# EAGLE design doch (EAGLE 9.6.2)
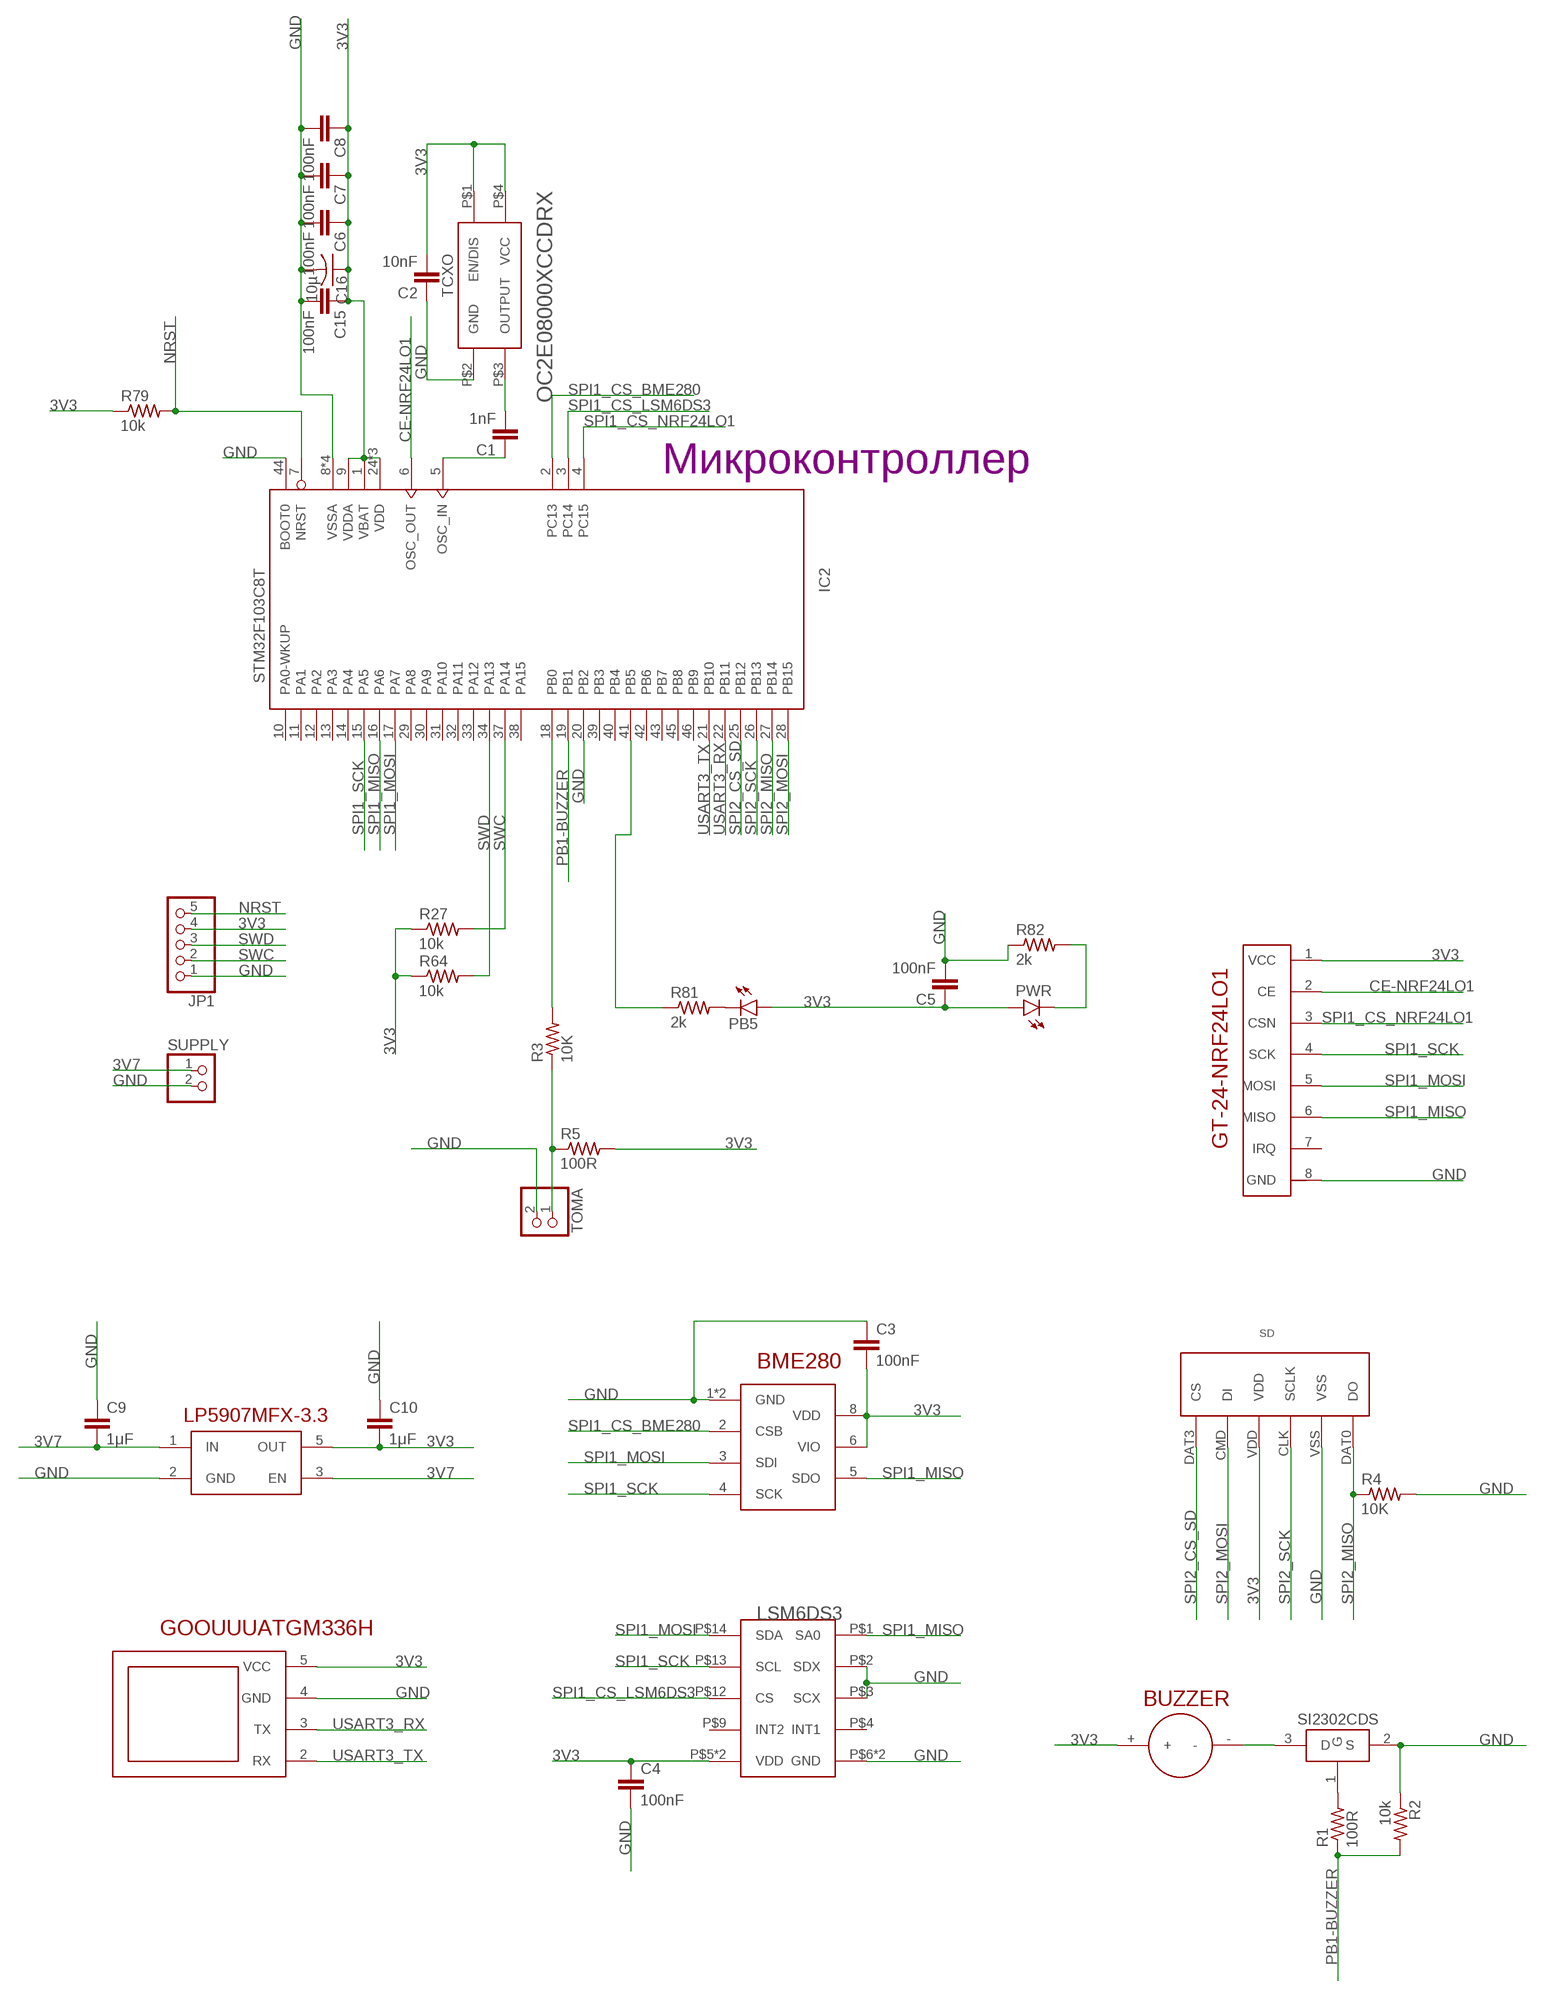
[diagram p0: schematic, sheet 1]

## Parts
BME280  BME280CHIP  [BME280CHIP]
BUZZER  BUZZER  [BUZZER]
C1  1nF  C-EUC0603  [C0603]
C2  10nF  C-EUC0603  [C0603]
C3  100nF  C-EUC0603  [C0603]
C4  100nF  C-EUC0603  [C0603]
C5  100nF  C-EUC0603  [C0603]
C6  100nF  C-EUC0603  [C0603]
C7  100nF  C-EUC0603  [C0603]
C8  100nF  C-EUC0603  [C0603]
C9  1μF  C-EUC0603  [C0603]
C10  1μF  C-EUC0603  [C0603]
C15  100nF  C-EUC0603  [C0603]
C16  10µ  C-USC1206  [C1206]
GOOUUUATGM336H  GOOUUUATGM336H  [GOOUUUATGM336H]
GT-24-NRF24LO1  GT-24-NRF24LO1  [GT-24-NRF24LO1]
IC2  STM32F103C8T  [LQFP48]
JP1  PINHD-1X5  [1X05]
LP5907MFX-3.3  LP5907MFX-3.3  [5PINSOT23]
LSM6DS3  LSM6DS3  [LGA-14]
PB5  LEDCHIPLED_0603  [CHIPLED_0603]
PWR  LEDCHIPLED_0603  [CHIPLED_0603]
R1  100R  R-US_R0603  [R0603]
R2  10k  R-US_R0603  [R0603]
R3  10K  R-US_R0603  [R0603]
R4  10K  R-US_R0603  [R0603]
R5  100R  R-US_R0603  [R0603]
R27  10k  R-US_R0603  [R0603]
R64  10k  R-US_R0603  [R0603]
R79  10k  R-US_R0603  [R0603]
R81  2k  R-US_R0603  [R0603]
R82  2k  R-US_R0603  [R0603]
SD  SD-SPI  [SD]
SUPPLY  PINHD-1X2  [1X02]
TCXO  OC2E08000XCCDRX  [OC2E08000XCCDRX]
TOMA  PINHD-1X2/90  [1X02/90]
U$1  SI2302CDS  [SOT23-3]

## Nets
3V3: BME280.6(VIO) BME280.8(VDD) BUZZER.+ C2.2 C3.2 C4.1 C5.1 C6.1 C7.1 C8.1 C10.2 C15.1 C16.1 GOOUUUATGM336H.5(VCC) GT-24-NRF24LO1.1(VCC) IC2.1(VBAT) IC2.9(VDDA) IC2.24(VDD) IC2.36(VDD) IC2.48(VDD) JP1.4 LP5907MFX-3.3.5(OUT) LSM6DS3.P$5(VDD) LSM6DS3.P$8(VDD) PB5.A PWR.A R5.2 R27.1 R64.1 R79.1 SD.VDD TCXO.P$1(EN/DIS) TCXO.P$4(VCC)
3V7: C9.2 LP5907MFX-3.3.1(IN) LP5907MFX-3.3.3(EN) SUPPLY.1
CE-NRF24LO1: GT-24-NRF24LO1.2(CE) IC2.6(OSC_OUT)
GND: BME280.1(GND) BME280.7(GND) C2.1 C3.1 C4.2 C5.2 C6.2 C7.2 C8.2 C9.1 C10.1 C15.2 C16.2 GOOUUUATGM336H.4(GND) GT-24-NRF24LO1.8(GND) IC2.8(VSSA) IC2.20(PB2) IC2.23(VSSA) IC2.35(VSSA) IC2.44(BOOT0) IC2.47(VSSA) JP1.1 LP5907MFX-3.3.2(GND) LSM6DS3.P$2(SDX) LSM6DS3.P$3(SCX) LSM6DS3.P$6(GND) LSM6DS3.P$7(GND) R2.1 R4.2 R82.1 SD.VSS SUPPLY.2 TCXO.P$2(GND) TOMA.2 U$1.2(S)
N$1: BUZZER.- U$1.3(D)
N$2: R1.2 U$1.1(G)
N$4: C1.2 TCXO.P$3(OUTPUT)
N$5: C1.1 IC2.5(OSC_IN)
N$8: R3.1 R5.1 TOMA.1
N$9: IC2.18(PB0) R3.2
N$17: PB5.C R81.2
N$159: PWR.C R82.2
N$161: IC2.41(PB5) R81.1
NRST: IC2.7(NRST) JP1.5 R79.2
PB1-BUZZER: IC2.19(PB1) R1.1 R2.2
SPI1_CS_BME280: BME280.2(CSB) IC2.2(PC13)
SPI1_CS_LSM6DS3: IC2.3(PC14) LSM6DS3.P$12(CS)
SPI1_CS_NRF24LO1: GT-24-NRF24LO1.3(CSN) IC2.4(PC15)
SPI1_MISO: BME280.5(SDO) GT-24-NRF24LO1.6(MISO) IC2.16(PA6) LSM6DS3.P$1(SA0)
SPI1_MOSI: BME280.3(SDI) GT-24-NRF24LO1.5(MOSI) IC2.17(PA7) LSM6DS3.P$14(SDA)
SPI1_SCK: BME280.4(SCK) GT-24-NRF24LO1.4(SCK) IC2.15(PA5) LSM6DS3.P$13(SCL)
SPI2_CS_SD: IC2.25(PB12) SD.DAT3(CS)
SPI2_MISO: IC2.27(PB14) R4.1 SD.DAT0(DO)
SPI2_MOSI: IC2.28(PB15) SD.CMD(DI)
SPI2_SCK: IC2.26(PB13) SD.CLK(SCLK)
SWC: IC2.37(PA14) JP1.2 R27.2
SWD: IC2.34(PA13) JP1.3 R64.2
USART3_RX: GOOUUUATGM336H.3(TX) IC2.22(PB11)
USART3_TX: GOOUUUATGM336H.2(RX) IC2.21(PB10)
Unconnected: GT-24-NRF24LO1.7(IRQ) IC2.10(PA0-WKUP) IC2.11(PA1) IC2.12(PA2) IC2.13(PA3) IC2.14(PA4) IC2.29(PA8) IC2.30(PA9) IC2.31(PA10) IC2.32(PA11) IC2.33(PA12) IC2.38(PA15) IC2.39(PB3) IC2.40(PB4) IC2.42(PB6) IC2.43(PB7) IC2.45(PB8) IC2.46(PB9) LSM6DS3.P$4(INT1) LSM6DS3.P$9(INT2)

## Notes on the sheet
- Микроконтроллер

## Library data of the parts
BME280 = CanCubeSat:BME280CHIP
BUZZER = CanCubeSat:BUZZER
C1-C10 C15 = rcl:C-EU: CAPACITOR, European symbol; SPICEPREFIX: C
C16 = rcl:C-US: CAPACITOR, American symbol; SPICEPREFIX: C
GOOUUUATGM336H = CanCubeSat:GOOUUUATGM336H
GT-24-NRF24LO1 = CanCubeSat:GT-24-NRF24LO1
IC2 = CanCubeSat:STM32F103C*T: ARM 32-bit Cortex™-M3 CPU 72 MHz maximum frequency 16 to 128 Kbytes of Flash memory 6 to 20 kbytes of SRAM 37 GPIOs 2.0 to 3.6 V application supply
JP1 = pinhead:PINHD-1X5: PIN HEADER
LP5907MFX-3.3 = CanCubeSat:LP5907MFX-3.3
LSM6DS3 = CanCubeSat:LSM6DS3
PB5 PWR = led:LED: LED OSRAM: - CHIPLED LG R971, LG N971, LY N971, LG Q971, LY Q971, LO R971, LY R971 LH N974, LH R974 LS Q976, LO Q976, LY Q976 LO Q996 - Hyper CHIPLED LW Q18S LB Q993, LB Q99A, LB R99A - SideLED LS A670, LO A670, LY A670, LG A670, LP A670 LB A673, LV A673, LT A673, LW A673 LH A674 LY A675 LS A676, LA A676, LO A676, LY A676, LW A676 LS A679, LY A679, LG A679 - Hyper Micro SIDELED® LS Y876, LA Y876, LO Y876, LY Y876 LT Y87S - SmartLED LW L88C, LW L88S LB L89C, LB L89S, LG L890 LS L89K, LO L89K, LY L89K LS L896, LA L896, LO L896, LY L896 - TOPLED LS T670, LO T670, LY T670, LG T670, LP T670 LSG T670, LSP T670, LSY T670, LOP T670, LYG T670 LG T671, LOG T671, LSG T671 LB T673, LV T673, LT T673, LW T673 LH T674 LS T676, LA T676, LO T676, LY T676, LB T676, LH T676, LSB T676, LW T676 LB T67C, LV T67C, LT T67C, LS T67K, LO T67K, LY T67K, LW E67C LS E67B, LA E67B, LO E67B, LY E67B, LB E67C, LV E67C, LT E67C LW T67C LS T679, LY T679, LG T679 LS T770, LO T770, LY T770, LG T770, LP T770 LB T773, LV T773, LT T773, LW T773 LH T774 LS E675, LA E675, LY E675, LS T675 LS T776, LA T776, LO T776, LY T776, LB T776 LHGB T686 LT T68C, LB T68C - Hyper Mini TOPLED® LB M676 - Mini TOPLED Santana® LG M470 LS M47K, LO M47K, LY M47K Source: http://www.osram.convergy.de LUXEON: - LUMILED® LXK2-PW12-R00, LXK2-PW12-S00, LXK2-PW14-U00, LXK2-PW14-V00 LXK2-PM12-R00, LXK2-PM12-S00, LXK2-PM14-U00 LXK2-PE12-Q00, LXK2-PE12-R00, LXK2-PE12-S00, LXK2-PE14-T00, LXK2-PE14-U00 LXK2-PB12-K00, LXK2-PB12-L00, LXK2-PB12-M00, LXK2-PB14-N00, LXK2-PB14-P00, LXK2-PB14-Q00 LXK2-PR12-L00, LXK2-PR12-M00, LXK2-PR14-Q00, LXK2-PR14-R00 LXK2-PD12-Q00, LXK2-PD12-R00, LXK2-PD12-S00 LXK2-PH12-R00, LXK2-PH12-S00 LXK2-PL12-P00, LXK2-PL12-Q00, LXK2-PL12-R00 Source: www.luxeon.com KINGBRIGHT: KA-3528ASYC Source: www.kingbright.com
R1-R5 = rcl:R-US_: RESISTOR, American symbol; SPICEPREFIX: R
R27 R64 R79 R81 R82 = resistor:R-US_: RESISTOR, American symbol
SD = CanCubeSat:SD-SPI
SUPPLY TOMA = pinhead:PINHD-1X2: PIN HEADER
TCXO = CanCubeSat:OC2E08000XCCDRX: TCXO OC2E08000XCCDRX 8 MHz
U$1 = CanCubeSat:SI2302CDS

## Board
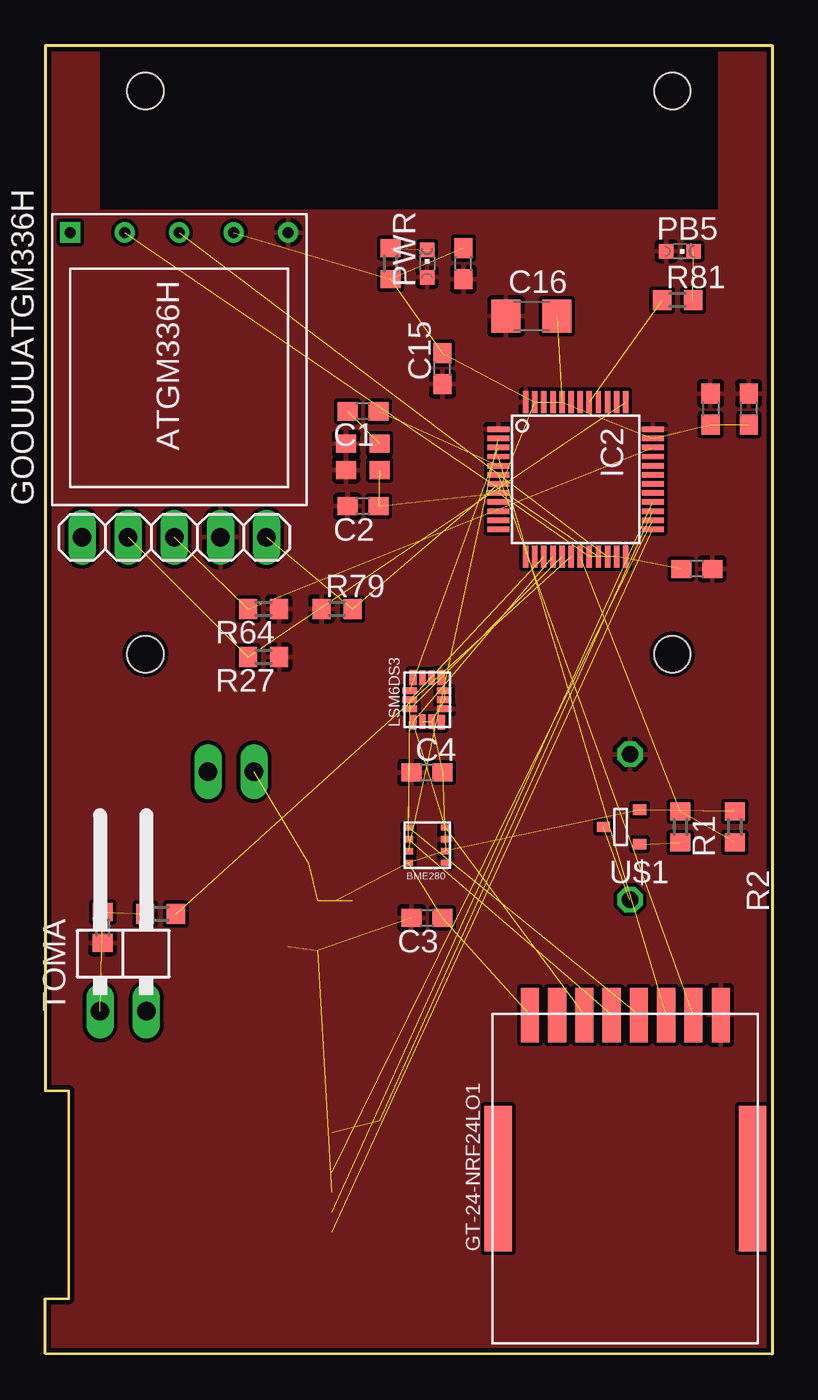
[diagram p1: board, top side]
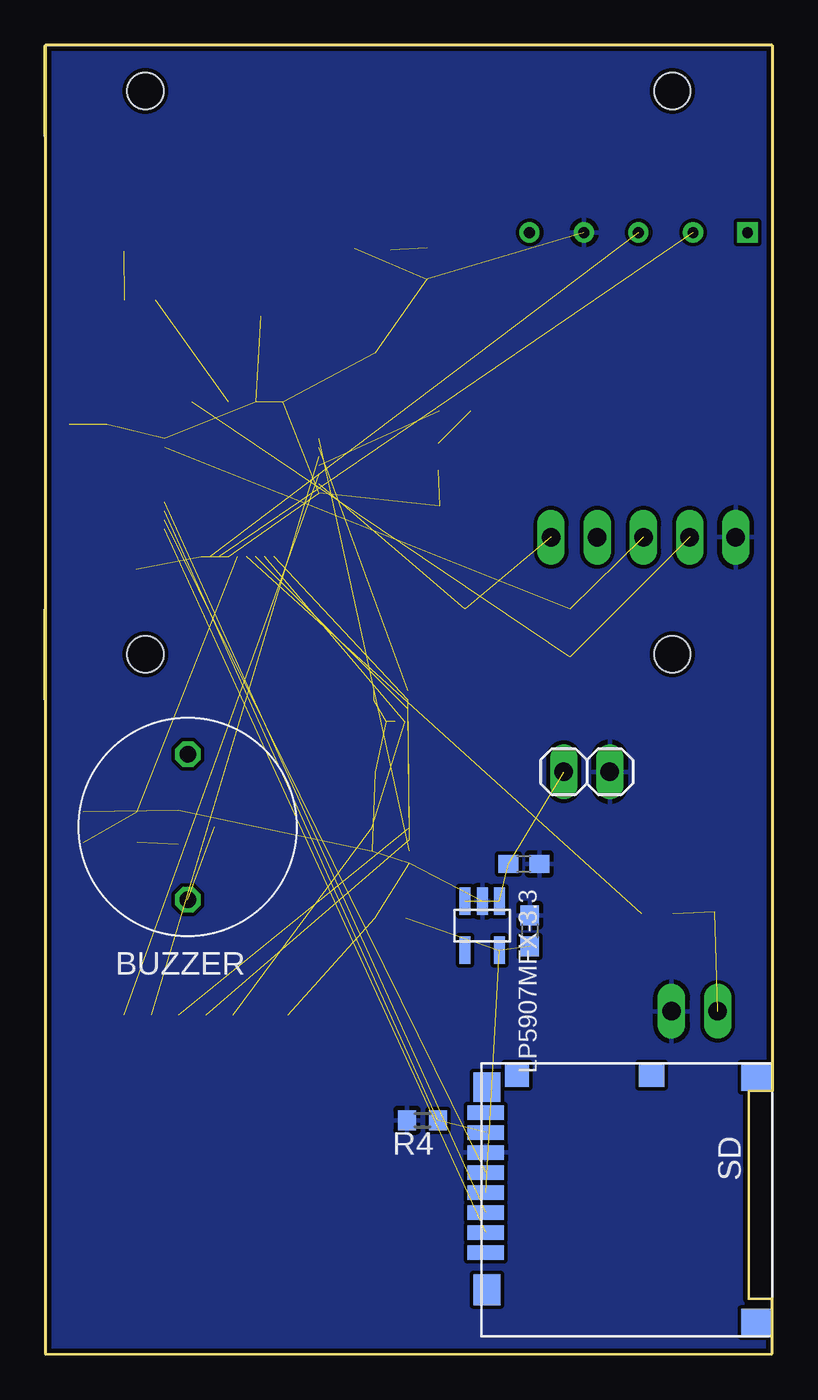
[diagram p2: board, bottom side, seen from below]

Size 40 x 72 mm. Coordinates in mm from the lower left corner, seen from the top.
Outline: 0,3.03 0,0.03 40,0 40,72 0,72 0,14.49
Copper layers (1*16): Top 0.035mm / dielectric 1.5mm / Bottom 0.035mm
Design rules "default *": minimum track width 0.2mm, minimum drill 0.35mm, track to track 0.2mm, track to pad 0.2mm, pad to pad 0.15mm, via to via 0.2mm, smd to smd 0.2mm, copper to edge 0.25mm, drill to drill 0.25mm, minimum pad ring 10mil, minimum via ring 8mil, stop-mask expansion 4mil, vias tented up to drill 0mil, thermal gap 10mil
Holes 2 mm at 5.5,38.5 34.5,38.5 34.5,69.5 5.5,69.5
tRestrict: area 3,63 to 37,72

### Footprints (pad centres in the part's own frame; a part is rotated, then mirrored left to right if it is on the bottom)
BME280CHIP = smd 0.5 x 0.35: 1 1.025,0.975; 2 1.025,0.325; 3 1.025,-0.325; 4 1.025,-0.975; 5 -1.025,-0.975; 6 -1.025,-0.325; 7 -1.025,0.325; 8 -1.025,0.975
BUZZER = drill 0.9 octagon: + 0,-4; - 0,4
C0603 = smd 1.1 x 1: 1 -0.85,0; 2 0.85,0
C1206 = smd 1.6 x 1.8: 1 -1.4,0; 2 1.4,0
GOOUUUATGM336H = drill 0.6 square: 1 7,6 | drill 0.6: 2 7,3; 3 7,0; 4 7,-3; 5 7,-6
GT-24-NRF24LO1 = smd 1 x 3: 1 5.25,9; 2 3.75,9; 3 2.25,9; 4 0.75,9; 5 -0.75,9; 6 -2.25,9; 7 -3.75,9; 8 -5.25,9 | smd 1.5 x 8: P$9 -7,0; P$10 7,0
LQFP48 = smd 0.3 x 1.2: 1 -2.75,-4.25; 2 -2.25,-4.25; 3 -1.75,-4.25; 4 -1.25,-4.25; 5 -0.75,-4.25; 6 -0.25,-4.25; 7 0.25,-4.25; 8 0.75,-4.25; 9 1.25,-4.25; 10 1.75,-4.25; 11 2.25,-4.25; 12 2.75,-4.25; 25 2.75,4.25; 26 2.25,4.25; 27 1.75,4.25; 28 1.25,4.25; 29 0.75,4.25; 30 0.25,4.25; 31 -0.25,4.25; 32 -0.75,4.25; 33 -1.25,4.25; 34 -1.75,4.25; 35 -2.25,4.25; 36 -2.75,4.25 | smd 1.2 x 0.3: 13 4.25,-2.75; 14 4.25,-2.25; 15 4.25,-1.75; 16 4.25,-1.25; 17 4.25,-0.75; 18 4.25,-0.25; 19 4.25,0.25; 20 4.25,0.75; 21 4.25,1.25; 22 4.25,1.75; 23 4.25,2.25; 24 4.25,2.75; 37 -4.25,2.75; 38 -4.25,2.25; 39 -4.25,1.75; 40 -4.25,1.25; 41 -4.25,0.75; 42 -4.25,0.25; 43 -4.25,-0.25; 44 -4.25,-0.75; 45 -4.25,-1.25; 46 -4.25,-1.75; 47 -4.25,-2.25; 48 -4.25,-2.75
1X05 = drill 1.016 long: 1 -5.08,0; 2 -2.54,0; 3 0,0; 4 2.54,0; 5 5.08,0
5PINSOT23 = smd 0.6 x 1.5: 1 -0.95,-1.35; 2 0,-1.35; 3 0.95,-1.35; 4 0.95,1.35; 5 -0.95,1.35
LGA-14 = smd 0.8 x 0.4: P$1 -1.225,0.775; P$4 -1.225,-0.775; P$8 1.225,-0.775; P$11 1.225,0.775 | smd 0.8 x 0.35: P$2 -1.2,0.25; P$3 -1.2,-0.25; P$9 1.2,-0.25; P$10 1.2,0.25 | smd 0.35 x 0.8: P$5 -0.5,-0.95; P$6 0,-0.95; P$7 0.5,-0.95; P$12 0.5,0.95; P$13 0,0.95; P$14 -0.5,0.95
CHIPLED_0603 = smd 0.8 x 0.8: A 0,-0.75; C 0,0.75
R0603 = smd 1 x 1.1: 1 -0.85,0; 2 0.85,0
SD = smd 0.8 x 2: CLK 6,-15.77; CMD 8.2,-15.77; DAT0 3.8,-15.77; DAT1 2.7,-15.77; DAT2 10.4,-15.77; DAT3 9.3,-15.77; VDD 7.1,-15.77; VSS 4.9,-15.77 | smd 1.5 x 1.7: P$9 0.75,-0.85; P$13 14.25,-0.85 | smd 1.6 x 1.5: P$10 1.3,-15.7 | smd 1.29 x 1.3: P$11 0.645,-14.05 | smd 1.29 x 1.4: P$12 0.645,-6.65 | smd 1.7 x 1.5: P$14 12.45,-15.7
1X02 = drill 1.016 long: 1 -1.27,0; 2 1.27,0
OC2E08000XCCDRX = smd 1.1 x 1: P$1 0.925,0.725; P$2 -0.925,0.725; P$3 -0.925,-0.725; P$4 0.925,-0.725
1X02/90 = drill 1.016 long: 1 -1.27,-3.81; 2 1.27,-3.81
SOT23-3 = smd 0.56 x 0.73: 1 -0.95,-1; 2 0.95,-1; 3 0,1

### Placement (x,y rotation side)
BME280  21,28 180 top
BUZZER  32.17,29 180 bottom
C1  17.47,51.87 180 top
C2  17.47,46.65 180 top
C3  21,24 180 top
C4  21,32 0 top
C5  23,60 90 top
C6  35.85,43.2 180 top
C7  36.6,52 270 top
C8  38.7,52 270 top
C9  13.67,26.97 180 bottom
C10  13.35,23.29 270 bottom
C15  21.85,54.22 90 top
C16  26.75,57.11 0 top
GOOUUUATGM336H  7.36,54.71 90 top
GT-24-NRF24LO1  31.91,9.66 0 top
IC2  29.18,48.13 270 top
JP1  7.09,44.94 0 top
LP5907MFX-3.3  15.96,23.57 180 bottom
LSM6DS3  21,36 90 top
PB5  34.91,60.67 270 top
PWR  21,60 0 top
R1  34.95,29 270 top
R2  37.93,29 270 top
R3  6.33,24.23 0 top
R4  19.25,12.87 180 bottom
R5  3.15,23.48 270 top
R27  12,38.35 180 top
R64  12,41 180 top
R79  16.05,41 0 top
R81  34.79,58 0 top
R82  19,60 90 top
SD  0,15.99 270 bottom
SUPPLY  10.21,32.04 0 bottom
TCXO  17.47,49.37 180 top
TOMA  4.28,22.67 0 top
U$1  31.7,29 90 top

### Tracks (layer width: path | path; a pad name or v marks a point on that pad's centre or on a via)
3V3  (3 unrouted)
  pour Top: -1,73 -1,-1 41,-1 41,73
3V7  (3 unrouted)
CE-NRF24LO1  (1 unrouted)
GND  (26 unrouted)
  pour Bottom: -2,-3 -2,75 43,75 43,-3
N$1  (1 unrouted)
N$2  (1 unrouted)
N$4  (1 unrouted)
N$5  (1 unrouted)
N$8  (2 unrouted)
N$9  (1 unrouted)
N$17  (1 unrouted)
N$159  (1 unrouted)
N$161  (1 unrouted)
NRST  (2 unrouted)
PB1-BUZZER  (2 unrouted)
SPI1_CS_BME280  (1 unrouted)
SPI1_CS_LSM6DS3  (1 unrouted)
SPI1_CS_NRF24LO1  (1 unrouted)
SPI1_MISO  (3 unrouted)
SPI1_MOSI  (3 unrouted)
SPI1_SCK  (3 unrouted)
SPI2_CS_SD  (1 unrouted)
SPI2_MISO  (2 unrouted)
SPI2_MOSI  (1 unrouted)
SPI2_SCK  (1 unrouted)
SWC  (2 unrouted)
SWD  (2 unrouted)
USART3_RX  (1 unrouted)
USART3_TX  (1 unrouted)